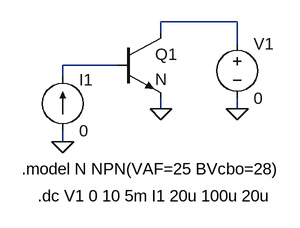
[diagram p0: schematic BVcbo.asc]
BVcbo.asc, the LTspice schematic file:
Version 4
SHEET 1 1072 680
WIRE 336 96 224 96
WIRE 224 112 224 96
WIRE 336 128 336 96
WIRE 160 160 80 160
WIRE 80 176 80 160
WIRE 224 224 224 208
WIRE 336 224 336 208
WIRE 80 272 80 256
FLAG 336 224 0
FLAG 224 224 0
FLAG 80 272 0
SYMBOL npn 160 112 R0
SYMATTR InstName Q1
SYMATTR Value N
SYMBOL current 80 256 M180
WINDOW 0 24 75 Left 0
WINDOW 3 24 0 Left 0
SYMATTR InstName I1
SYMATTR Value 0
SYMBOL voltage 336 112 R0
SYMATTR InstName V1
SYMATTR Value 0
TEXT 216 336 Top 0 !.dc V1 0 10 5m I1 20u 100u 20u
TEXT 208 296 Top 0 !.model N NPN(VAF=25 BVcbo=28)

The netlist it stands for:
* BVcbo.asc
Q1 N001 N002 0 0 N
I1 0 N002 0
V1 N001 0 0
.model NPN NPN
.model PNP PNP
.lib standard.bjt
.dc V1 0 10 5m I1 20u 100u 20u
.model N NPN(VAF=25 BVcbo=28)
.backanno
.end